# Altium project HMC1053-array.PrjPcb
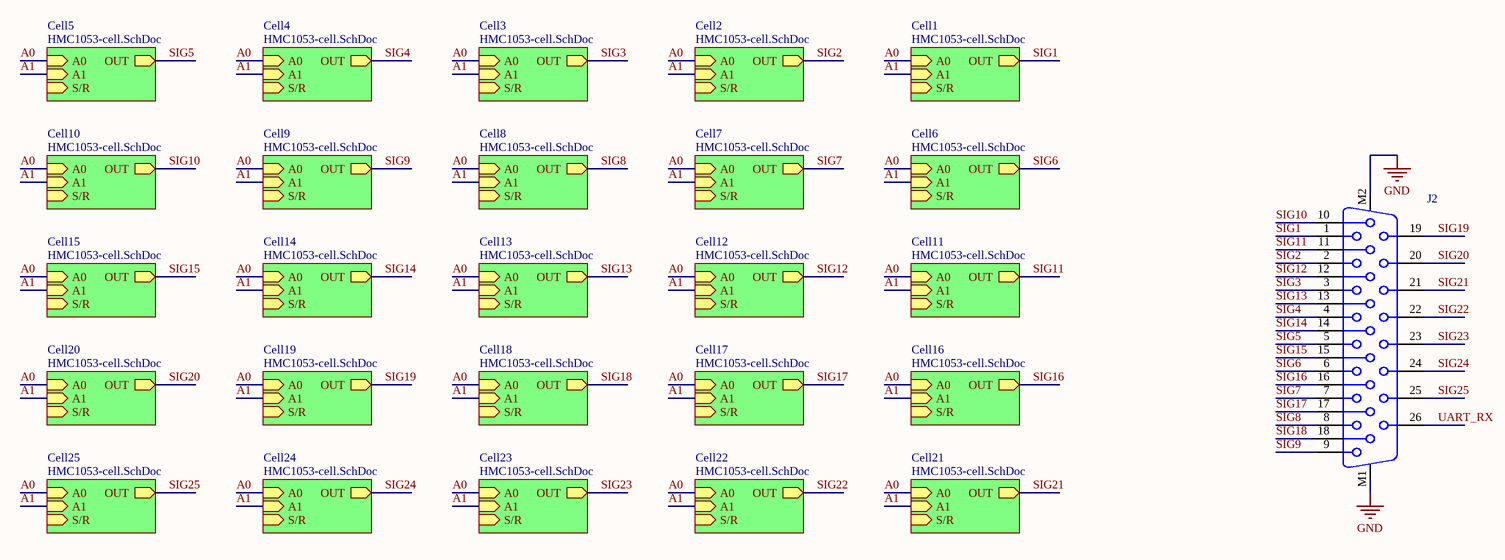
[diagram p0: Schematic.SchDoc]
2 sheets, 151 parts. Net scope: hierarchical (ports join the sheet entries above them; power ports are global).
Board file: PCB.PcbDoc
Sheets:
  Schematic.SchDoc
    Cell1 = HMC1053-cell.SchDoc
    Cell2 = HMC1053-cell.SchDoc
    Cell3 = HMC1053-cell.SchDoc
    Cell4 = HMC1053-cell.SchDoc
    Cell5 = HMC1053-cell.SchDoc
    Cell6 = HMC1053-cell.SchDoc
    Cell7 = HMC1053-cell.SchDoc
    Cell8 = HMC1053-cell.SchDoc
    Cell9 = HMC1053-cell.SchDoc
    Cell10 = HMC1053-cell.SchDoc
    Cell11 = HMC1053-cell.SchDoc
    Cell12 = HMC1053-cell.SchDoc
    Cell13 = HMC1053-cell.SchDoc
    Cell14 = HMC1053-cell.SchDoc
    Cell15 = HMC1053-cell.SchDoc
    Cell16 = HMC1053-cell.SchDoc
    Cell17 = HMC1053-cell.SchDoc
    Cell18 = HMC1053-cell.SchDoc
    Cell19 = HMC1053-cell.SchDoc
    Cell20 = HMC1053-cell.SchDoc
    Cell21 = HMC1053-cell.SchDoc
    Cell22 = HMC1053-cell.SchDoc
    Cell23 = HMC1053-cell.SchDoc
    Cell24 = HMC1053-cell.SchDoc
    Cell25 = HMC1053-cell.SchDoc

## Sheet Schematic.SchDoc
size B; SheetNumber: 1; SheetTotal: 2

### Parts
J2  D-sub_26  [D-sub_26]  (value not drawn)

### Sub-sheets
Cell1 = HMC1053-cell.SchDoc: OUT (out), A0 (in), A1 (in), S/R (in)
Cell2 = HMC1053-cell.SchDoc: OUT (out), A0 (in), A1 (in), S/R (in)
Cell3 = HMC1053-cell.SchDoc: OUT (out), A0 (in), A1 (in), S/R (in)
Cell4 = HMC1053-cell.SchDoc: OUT (out), A0 (in), A1 (in), S/R (in)
Cell5 = HMC1053-cell.SchDoc: OUT (out), A0 (in), A1 (in), S/R (in)
Cell6 = HMC1053-cell.SchDoc: OUT (out), A0 (in), A1 (in), S/R (in)
Cell7 = HMC1053-cell.SchDoc: OUT (out), A0 (in), A1 (in), S/R (in)
Cell8 = HMC1053-cell.SchDoc: OUT (out), A0 (in), A1 (in), S/R (in)
Cell9 = HMC1053-cell.SchDoc: OUT (out), A0 (in), A1 (in), S/R (in)
Cell10 = HMC1053-cell.SchDoc: OUT (out), A0 (in), A1 (in), S/R (in)
Cell11 = HMC1053-cell.SchDoc: OUT (out), A0 (in), A1 (in), S/R (in)
Cell12 = HMC1053-cell.SchDoc: OUT (out), A0 (in), A1 (in), S/R (in)
Cell13 = HMC1053-cell.SchDoc: OUT (out), A0 (in), A1 (in), S/R (in)
Cell14 = HMC1053-cell.SchDoc: OUT (out), A0 (in), A1 (in), S/R (in)
Cell15 = HMC1053-cell.SchDoc: OUT (out), A0 (in), A1 (in), S/R (in)
Cell16 = HMC1053-cell.SchDoc: OUT (out), A0 (in), A1 (in), S/R (in)
Cell17 = HMC1053-cell.SchDoc: OUT (out), A0 (in), A1 (in), S/R (in)
Cell18 = HMC1053-cell.SchDoc: OUT (out), A0 (in), A1 (in), S/R (in)
Cell19 = HMC1053-cell.SchDoc: OUT (out), A0 (in), A1 (in), S/R (in)
Cell20 = HMC1053-cell.SchDoc: OUT (out), A0 (in), A1 (in), S/R (in)
Cell21 = HMC1053-cell.SchDoc: OUT (out), A0 (in), A1 (in), S/R (in)
Cell22 = HMC1053-cell.SchDoc: OUT (out), A0 (in), A1 (in), S/R (in)
Cell23 = HMC1053-cell.SchDoc: OUT (out), A0 (in), A1 (in), S/R (in)
Cell24 = HMC1053-cell.SchDoc: OUT (out), A0 (in), A1 (in), S/R (in)
Cell25 = HMC1053-cell.SchDoc: OUT (out), A0 (in), A1 (in), S/R (in)

### Nets
GND: J2.M1 J2.M2
A0: sheet Cell1/A0, sheet Cell2/A0, sheet Cell3/A0, sheet Cell4/A0, sheet Cell5/A0, sheet Cell6/A0, sheet Cell7/A0, sheet Cell8/A0, sheet Cell9/A0, sheet Cell10/A0, sheet Cell11/A0, sheet Cell12/A0, sheet Cell13/A0, sheet Cell14/A0, sheet Cell15/A0, sheet Cell16/A0, sheet Cell17/A0, sheet Cell18/A0, sheet Cell19/A0, sheet Cell20/A0, sheet Cell21/A0, sheet Cell22/A0, sheet Cell23/A0, sheet Cell24/A0, sheet Cell25/A0
A1: sheet Cell1/A1, sheet Cell2/A1, sheet Cell3/A1, sheet Cell4/A1, sheet Cell5/A1, sheet Cell6/A1, sheet Cell7/A1, sheet Cell8/A1, sheet Cell9/A1, sheet Cell10/A1, sheet Cell11/A1, sheet Cell12/A1, sheet Cell13/A1, sheet Cell14/A1, sheet Cell15/A1, sheet Cell16/A1, sheet Cell17/A1, sheet Cell18/A1, sheet Cell19/A1, sheet Cell20/A1, sheet Cell21/A1, sheet Cell22/A1, sheet Cell23/A1, sheet Cell24/A1, sheet Cell25/A1
SIG1: J2.1 ; sheet Cell1/OUT  [project net OUT]
SIG2: J2.2 ; sheet Cell2/OUT  [project net OUT]
SIG3: J2.3 ; sheet Cell3/OUT  [project net OUT]
SIG4: J2.4 ; sheet Cell4/OUT  [project net OUT]
SIG5: J2.5 ; sheet Cell5/OUT  [project net OUT]
SIG6: J2.6 ; sheet Cell6/OUT  [project net OUT]
SIG7: J2.7 ; sheet Cell7/OUT  [project net OUT]
SIG8: J2.8 ; sheet Cell8/OUT  [project net OUT]
SIG9: J2.9 ; sheet Cell9/OUT  [project net OUT]
SIG10: J2.10 ; sheet Cell10/OUT  [project net OUT]
SIG11: J2.11 ; sheet Cell11/OUT  [project net OUT]
SIG12: J2.12 ; sheet Cell12/OUT  [project net OUT]
SIG13: J2.13 ; sheet Cell13/OUT  [project net OUT]
SIG14: J2.14 ; sheet Cell14/OUT  [project net OUT]
SIG15: J2.15 ; sheet Cell15/OUT  [project net OUT]
SIG16: J2.16 ; sheet Cell16/OUT  [project net OUT]
SIG17: J2.17 ; sheet Cell17/OUT  [project net OUT]
SIG18: J2.18 ; sheet Cell18/OUT  [project net OUT]
SIG19: J2.19 ; sheet Cell19/OUT  [project net OUT]
SIG20: J2.20 ; sheet Cell20/OUT  [project net OUT]
SIG21: J2.21 ; sheet Cell21/OUT  [project net OUT]
SIG22: J2.22 ; sheet Cell22/OUT  [project net OUT]
SIG23: J2.23 ; sheet Cell23/OUT  [project net OUT]
SIG24: J2.24 ; sheet Cell24/OUT  [project net OUT]
SIG25: J2.25 ; sheet Cell25/OUT  [project net OUT]
UART_RX: J2.26

### Library data of the parts
J2 = D-sub_26: Female High Density PCB Connector with Hex Screw WR-DSUB, Angled, 26 pins; Manufacturer: Wurth Elektronik; Part Number: 618026330923; Working Voltage: 60VAC; Pin Number: 26; Contact Resistance: 30mOhm; Rated Current: 3A; Gender: Female; Packaging: Tray; Datasheet URL: https://katalog.we-online.de/em/datasheet/6180xx330923.pdf; Package Reference: 618026330923; Publisher: WurthElektronik; Orientation: Angled; Manufacturer URL: http://www.we-online.de; Operating Temperature: -40to85degC; Mounting Technology: THT

## Sheet HMC1053-cell.SchDoc
size A; SheetNumber: 2; SheetTotal: 2
Used 25 times, as channels Cell1, Cell2, Cell3, Cell4, Cell5, Cell6, Cell7, Cell8, Cell9, Cell10, Cell11, Cell12, Cell13, Cell14, Cell15, Cell16, Cell17, Cell18, Cell19, Cell20, Cell21, Cell22, Cell23, Cell24, Cell25. Parts and nets are listed once, with the designators drawn on the sheet.
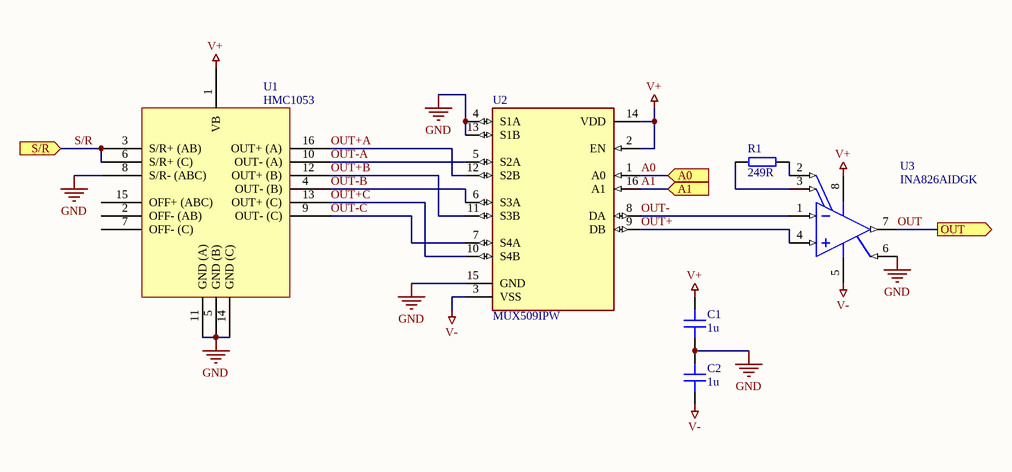
[diagram p1: HMC1053-cell.SchDoc]

### Parts
C1  1u  [CAP_0402]
C2  1u  [CAP_0402]
R1  249R  [RES_0402]
U1  HMC1053  [HMC1053]
U2  MUX509IPW  [MUX509IPW]
U3  INA826AIDGK  [INA826AIDGK]

### Ports
A0 (in, see Schematic[4A]), A1 (in, see Schematic[4A]), OUT (out, see Schematic[4A]), S/R (in, see Schematic[4A])

### Nets
GND: C1.1 C2.2 U1.5(GND_(B)) U1.8(S/R-_(ABC)) U1.11(GND_(A)) U1.14(GND_(C)) U2.4(S1A) U2.13(S1B) U2.15(GND) U3.6(REF)
V+: C1.2 U1.1(VB) U2.2(EN) U2.14(VDD) U3.8(VS+)
V-: C2.1 U2.3(VSS) U3.5(VS-)
A0: U2.1(A0) ; port A0
A1: U2.16(A1) ; port A1
OUT: U3.7(VOUT) ; port OUT
OUT+: U2.9(DB) U3.4(IN+)
OUT+A: U1.16(OUT+_(A)) U2.12(S2B)
OUT+B: U1.12(OUT+_(B)) U2.11(S3B)
OUT+C: U1.13(OUT+_(C)) U2.10(S4B)
OUT-: U2.8(DA) U3.1(IN-)
OUT-A: U1.10(OUT-_(A)) U2.5(S2A)
OUT-B: U1.4(OUT-_(B)) U2.6(S3A)
OUT-C: U1.9(OUT-_(C)) U2.7(S4A)
S/R: U1.3(S/R+_(AB)) U1.6(S/R+_(C)) ; port S/R
NetR1_1: R1.1 U3.2(RG)
NetR1_2: R1.2 U3.3(RG)

Not connected (* = marked no-connect by the designer): U1 2(OFF-_(AB)) 7(OFF-_(C)) 15(OFF+_(ABC))

### Channels
Cell1: designators end in _Cell1; ports A0=A0 A1=A1 OUT=OUT S/R=S/R_Cell1
Cell2: designators end in _Cell2; ports A0=A0 A1=A1 OUT=OUT S/R=S/R_Cell2
Cell3: designators end in _Cell3; ports A0=A0 A1=A1 OUT=OUT S/R=S/R_Cell3
Cell4: designators end in _Cell4; ports A0=A0 A1=A1 OUT=OUT S/R=S/R_Cell4
Cell5: designators end in _Cell5; ports A0=A0 A1=A1 OUT=OUT S/R=S/R_Cell5
Cell6: designators end in _Cell6; ports A0=A0 A1=A1 OUT=OUT S/R=S/R_Cell6
Cell7: designators end in _Cell7; ports A0=A0 A1=A1 OUT=OUT S/R=S/R_Cell7
Cell8: designators end in _Cell8; ports A0=A0 A1=A1 OUT=OUT S/R=S/R_Cell8
Cell9: designators end in _Cell9; ports A0=A0 A1=A1 OUT=OUT S/R=S/R_Cell9
Cell10: designators end in _Cell10; ports A0=A0 A1=A1 OUT=OUT S/R=S/R_Cell10
Cell11: designators end in _Cell11; ports A0=A0 A1=A1 OUT=OUT S/R=S/R_Cell11
Cell12: designators end in _Cell12; ports A0=A0 A1=A1 OUT=OUT S/R=S/R_Cell12
Cell13: designators end in _Cell13; ports A0=A0 A1=A1 OUT=OUT S/R=S/R_Cell13
Cell14: designators end in _Cell14; ports A0=A0 A1=A1 OUT=OUT S/R=S/R_Cell14
Cell15: designators end in _Cell15; ports A0=A0 A1=A1 OUT=OUT S/R=S/R_Cell15
Cell16: designators end in _Cell16; ports A0=A0 A1=A1 OUT=OUT S/R=S/R_Cell16
Cell17: designators end in _Cell17; ports A0=A0 A1=A1 OUT=OUT S/R=S/R_Cell17
Cell18: designators end in _Cell18; ports A0=A0 A1=A1 OUT=OUT S/R=S/R_Cell18
Cell19: designators end in _Cell19; ports A0=A0 A1=A1 OUT=OUT S/R=S/R_Cell19
Cell20: designators end in _Cell20; ports A0=A0 A1=A1 OUT=OUT S/R=S/R_Cell20
Cell21: designators end in _Cell21; ports A0=A0 A1=A1 OUT=OUT S/R=S/R_Cell21
Cell22: designators end in _Cell22; ports A0=A0 A1=A1 OUT=OUT S/R=S/R_Cell22
Cell23: designators end in _Cell23; ports A0=A0 A1=A1 OUT=OUT S/R=S/R_Cell23
Cell24: designators end in _Cell24; ports A0=A0 A1=A1 OUT=OUT S/R=S/R_Cell24
Cell25: designators end in _Cell25; ports A0=A0 A1=A1 OUT=OUT S/R=S/R_Cell25

### Library data of the parts
C1 C2 = CAP_0402: Capacitor SMD 0402; Voltage: 50V; Capacitance: 1u
R1 = RES_0402: Resistor SMD 0402; Resistance: 249R
U1 = HMC1053: 3-axis magnetoresistive sensor; Manufacturer: Honeywell; Operating Supply Voltage: 3V; Output Type: Wheatstone Bridge; Axis: X, Y, Z; Nominal Supply Current: 500mA; Min Supply Voltage: 1.8V; Max Supply Voltage: 20V; Bandwidth: 5MHz; Supplier 1: Newark; Manufacturer Part Number: HMC1053; RoHS: No; Category: Magnetic Sensors; Case/Package: PLCC; Number of Pins: 16; Min Operating Temperature: -40°C; Max Operating Temperature: 125°C; Package Quantity: 66; Packaging: Tape and Reel; Sensing Method: Magnetoresistive; Length: 7.4mm; Width: 7.4mm; Height: 2.5mm; Radiation Hardening: No; ComponentLink1URL: https://datasheet.ciiva.com/15099/getdatasheetpartid-59250-15099355.pdf?src-supplier=Verical; ComponentLink1Description: https://datasheet.ciiva.com/15099/getdatasheetpartid-59250-15099355.pdf?src-supplier=Verical; ComponentLink2URL: https://datasheet.ciiva.com/2816/hmc-1051-1052-1053-data-sheet-2816521.pdf?src-supplier=Digi-Key; ComponentLink2Description: https://datasheet.ciiva.com/2816/hmc-1051-1052-1053-data-sheet-2816521.pdf?src-supplier=Digi-Key
U2 = MUX509IPW: IC MUX DUAL 4:1 170 OHM 16TSSOP; Number of Circuits: 4; Number of Channels: 2; On-State Resistance: 250R; Number of Pins: 16; Case/Package: TSSOP; Min Operating Temperature: -40°C; Max Operating Temperature: 125°C; REACH SVHC: No SVHC; RoHS Compliant: Yes; Packaging: Cut Tape; Lead Free: Lead Free
U3 = INA826AIDGK: Precision, 200-uA Supply Current, 36-V Supply Instrumentation Amplifier, -40 to 125 degC, 8-pin SOP (DGK8), Green (RoHS & no Sb/Br); Manufacturer: Texas Instruments; Quiescent Current (+/-)(Typ)(mA): 0.2; Noise at 1kHz(Typ)(nV/rt(Hz)): 18; Input Offset (+/-)(Max)(uV): 150; Vs(Min)(V): 2.7; Number of Channels: 1; SubFamily: Single Supply; Output Offset Drift (+/-)(Max)(uV/Degrees Celsius): 10; Input Bias Current (+/-)(Max)(nA): 65; CMRR(Min)(dB): 84; Vs(Max)(V): 36; Non-Linearity (+/-)(Max)(%): 0.0005; Gain(V/V): 1 to 1000; Input Offset Drift (+/-)(Max)(uV/Degrees Celsius): 2; Output Offset (+/-)(Max)(uV): 700; Code_JEDEC: MO-187; PackageReference: DGK0008A; ComponentLink1Description: Manufacturer URL; ComponentLink3URL: http://www.ti.com/litv/pdf/mpds028d; PartNumber: INA826AIDGK; DatasheetVersion: SBOS562E; ComponentLink2Description: Datasheet; PackageDescription: 8-Pin Thin Small Outline, Body 3 x 3 mm, Pitch 0.65 mm; ComponentLink1URL: http://www.ti.com/; Mounting Technology: Surface Mount; ComponentLink2URL: http://www.ti.com/general/docs/lit/getliterature.tsp?genericPartNumber=INA826&fileType=pdf; ComponentLink3Description: Package Specification; Eco-Plan: Green (RoHS & no Sb/Br); PackageVersion: 4073329/E, 05/2006

## Nets that join several sheets
GND: Schematic (J2.M1 J2.M2), Cell1 (10 pins), Cell2 (10 pins), Cell3 (10 pins), Cell4 (10 pins), Cell5 (10 pins), Cell6 (10 pins), Cell7 (10 pins), Cell8 (10 pins), Cell9 (10 pins), Cell10 (10 pins), Cell11 (10 pins), Cell12 (10 pins), Cell13 (10 pins), Cell14 (10 pins), Cell15 (10 pins), Cell16 (10 pins), Cell17 (10 pins), Cell18 (10 pins), Cell19 (10 pins), Cell20 (10 pins), Cell21 (10 pins), Cell22 (10 pins), Cell23 (10 pins), Cell24 (10 pins), Cell25 (10 pins)
V+: Cell1 (5 pins), Cell2 (5 pins), Cell3 (5 pins), Cell4 (5 pins), Cell5 (5 pins), Cell6 (5 pins), Cell7 (5 pins), Cell8 (5 pins), Cell9 (5 pins), Cell10 (5 pins), Cell11 (5 pins), Cell12 (5 pins), Cell13 (5 pins), Cell14 (5 pins), Cell15 (5 pins), Cell16 (5 pins), Cell17 (5 pins), Cell18 (5 pins), Cell19 (5 pins), Cell20 (5 pins), Cell21 (5 pins), Cell22 (5 pins), Cell23 (5 pins), Cell24 (5 pins), Cell25 (5 pins)
V-: Cell1 (C2_Cell1.1 U2_Cell1.3 U3_Cell1.5), Cell2 (C2_Cell2.1 U2_Cell2.3 U3_Cell2.5), Cell3 (C2_Cell3.1 U2_Cell3.3 U3_Cell3.5), Cell4 (C2_Cell4.1 U2_Cell4.3 U3_Cell4.5), Cell5 (C2_Cell5.1 U2_Cell5.3 U3_Cell5.5), Cell6 (C2_Cell6.1 U2_Cell6.3 U3_Cell6.5), Cell7 (C2_Cell7.1 U2_Cell7.3 U3_Cell7.5), Cell8 (C2_Cell8.1 U2_Cell8.3 U3_Cell8.5), Cell9 (C2_Cell9.1 U2_Cell9.3 U3_Cell9.5), Cell10 (C2_Cell10.1 U2_Cell10.3 U3_Cell10.5), Cell11 (C2_Cell11.1 U2_Cell11.3 U3_Cell11.5), Cell12 (C2_Cell12.1 U2_Cell12.3 U3_Cell12.5), Cell13 (C2_Cell13.1 U2_Cell13.3 U3_Cell13.5), Cell14 (C2_Cell14.1 U2_Cell14.3 U3_Cell14.5), Cell15 (C2_Cell15.1 U2_Cell15.3 U3_Cell15.5), Cell16 (C2_Cell16.1 U2_Cell16.3 U3_Cell16.5), Cell17 (C2_Cell17.1 U2_Cell17.3 U3_Cell17.5), Cell18 (C2_Cell18.1 U2_Cell18.3 U3_Cell18.5), Cell19 (C2_Cell19.1 U2_Cell19.3 U3_Cell19.5), Cell20 (C2_Cell20.1 U2_Cell20.3 U3_Cell20.5), Cell21 (C2_Cell21.1 U2_Cell21.3 U3_Cell21.5), Cell22 (C2_Cell22.1 U2_Cell22.3 U3_Cell22.5), Cell23 (C2_Cell23.1 U2_Cell23.3 U3_Cell23.5), Cell24 (C2_Cell24.1 U2_Cell24.3 U3_Cell24.5), Cell25 (C2_Cell25.1 U2_Cell25.3 U3_Cell25.5)
A0: Cell1 (U2_Cell1.1), Cell2 (U2_Cell2.1), Cell3 (U2_Cell3.1), Cell4 (U2_Cell4.1), Cell5 (U2_Cell5.1), Cell6 (U2_Cell6.1), Cell7 (U2_Cell7.1), Cell8 (U2_Cell8.1), Cell9 (U2_Cell9.1), Cell10 (U2_Cell10.1), Cell11 (U2_Cell11.1), Cell12 (U2_Cell12.1), Cell13 (U2_Cell13.1), Cell14 (U2_Cell14.1), Cell15 (U2_Cell15.1), Cell16 (U2_Cell16.1), Cell17 (U2_Cell17.1), Cell18 (U2_Cell18.1), Cell19 (U2_Cell19.1), Cell20 (U2_Cell20.1), Cell21 (U2_Cell21.1), Cell22 (U2_Cell22.1), Cell23 (U2_Cell23.1), Cell24 (U2_Cell24.1), Cell25 (U2_Cell25.1)
A1: Cell1 (U2_Cell1.16), Cell2 (U2_Cell2.16), Cell3 (U2_Cell3.16), Cell4 (U2_Cell4.16), Cell5 (U2_Cell5.16), Cell6 (U2_Cell6.16), Cell7 (U2_Cell7.16), Cell8 (U2_Cell8.16), Cell9 (U2_Cell9.16), Cell10 (U2_Cell10.16), Cell11 (U2_Cell11.16), Cell12 (U2_Cell12.16), Cell13 (U2_Cell13.16), Cell14 (U2_Cell14.16), Cell15 (U2_Cell15.16), Cell16 (U2_Cell16.16), Cell17 (U2_Cell17.16), Cell18 (U2_Cell18.16), Cell19 (U2_Cell19.16), Cell20 (U2_Cell20.16), Cell21 (U2_Cell21.16), Cell22 (U2_Cell22.16), Cell23 (U2_Cell23.16), Cell24 (U2_Cell24.16), Cell25 (U2_Cell25.16)
OUT: Schematic (J2.11), Cell11 (U3_Cell11.7)
OUT: Schematic (J2.12), Cell12 (U3_Cell12.7)
OUT: Schematic (J2.13), Cell13 (U3_Cell13.7)
OUT: Schematic (J2.14), Cell14 (U3_Cell14.7)
OUT: Schematic (J2.15), Cell15 (U3_Cell15.7)
OUT: Schematic (J2.1), Cell1 (U3_Cell1.7)
OUT: Schematic (J2.2), Cell2 (U3_Cell2.7)
OUT: Schematic (J2.3), Cell3 (U3_Cell3.7)
OUT: Schematic (J2.4), Cell4 (U3_Cell4.7)
OUT: Schematic (J2.5), Cell5 (U3_Cell5.7)
OUT: Schematic (J2.10), Cell10 (U3_Cell10.7)
OUT: Schematic (J2.6), Cell6 (U3_Cell6.7)
OUT: Schematic (J2.7), Cell7 (U3_Cell7.7)
OUT: Schematic (J2.8), Cell8 (U3_Cell8.7)
OUT: Schematic (J2.9), Cell9 (U3_Cell9.7)
OUT: Schematic (J2.16), Cell16 (U3_Cell16.7)
OUT: Schematic (J2.17), Cell17 (U3_Cell17.7)
OUT: Schematic (J2.18), Cell18 (U3_Cell18.7)
OUT: Schematic (J2.19), Cell19 (U3_Cell19.7)
OUT: Schematic (J2.20), Cell20 (U3_Cell20.7)
OUT: Schematic (J2.21), Cell21 (U3_Cell21.7)
OUT: Schematic (J2.22), Cell22 (U3_Cell22.7)
OUT: Schematic (J2.23), Cell23 (U3_Cell23.7)
OUT: Schematic (J2.24), Cell24 (U3_Cell24.7)
OUT: Schematic (J2.25), Cell25 (U3_Cell25.7)